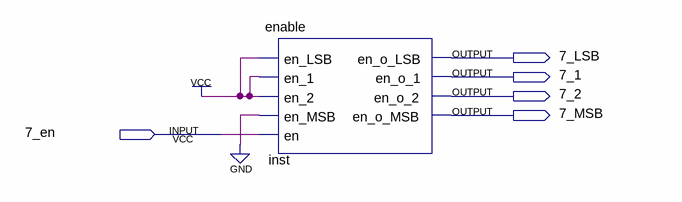
[diagram p0: schematic sheet]
// Quartus schematic 7_en.bdf as structural Verilog: 1 symbols, 5 pins
module \7_en  (
  input  \7_en ,
  output \7_LSB ,
  output \7_1 ,
  output \7_2 ,
  output \7_MSB 
);

  enable inst (
    .en_LSB(1'b1), .en_1(1'b1), .en_2(1'b1), .en_MSB(1'b0), .en(\7_en ), .en_o_LSB(\7_LSB ), .en_o_1(\7_1 ),
    .en_o_2(\7_2 ), .en_o_MSB(\7_MSB ));
endmodule
